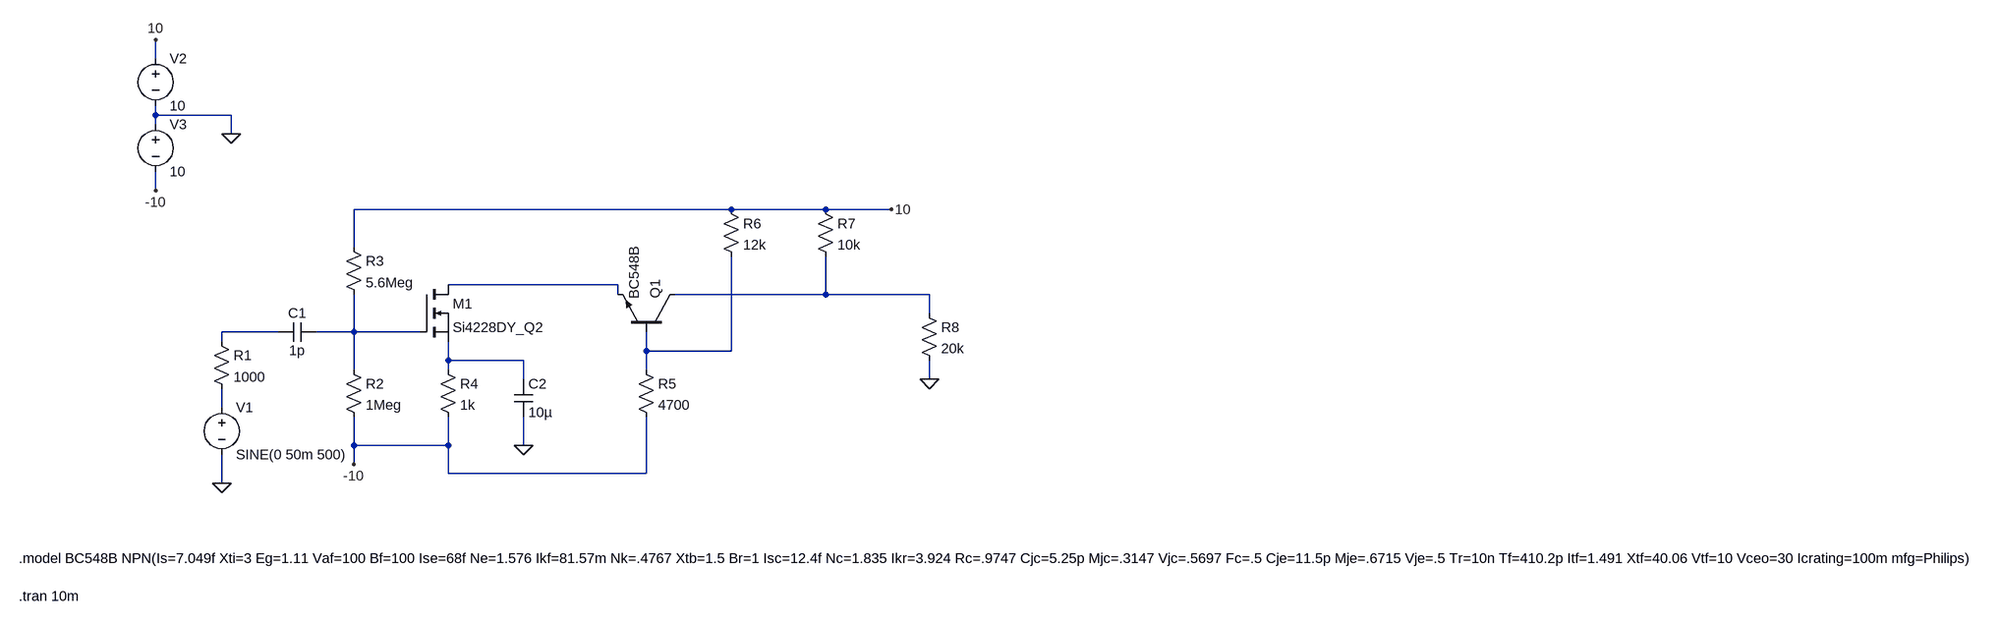
[diagram p0: schematic parcial1.asc]
parcial1.asc, the LTspice schematic file:
Version 4
SHEET 1 3312 680
WIRE -176 -416 -176 -448
WIRE -176 -320 -176 -336
WIRE -48 -320 -176 -320
WIRE -176 -304 -176 -320
WIRE -48 -288 -48 -320
WIRE -176 -192 -176 -224
WIRE 800 -160 160 -160
WIRE 960 -160 800 -160
WIRE 1072 -160 960 -160
WIRE 160 -96 160 -160
WIRE 608 -32 320 -32
WIRE 608 -16 608 -32
WIRE 960 -16 960 -80
WIRE 960 -16 704 -16
WIRE 1136 -16 960 -16
WIRE 1136 16 1136 -16
WIRE 32 48 -64 48
WIRE 160 48 160 -16
WIRE 160 48 96 48
WIRE 272 48 160 48
WIRE -64 64 -64 48
WIRE 656 80 656 48
WIRE 800 80 800 -80
WIRE 800 80 656 80
WIRE 320 96 320 64
WIRE 448 96 320 96
WIRE 160 112 160 48
WIRE 320 112 320 96
WIRE 656 112 656 80
WIRE 448 128 448 96
WIRE 1136 128 1136 96
WIRE -64 176 -64 144
WIRE 160 240 160 192
WIRE 320 240 320 192
WIRE 320 240 160 240
WIRE 448 240 448 192
WIRE 160 272 160 240
WIRE 320 288 320 240
WIRE 656 288 656 192
WIRE 656 288 320 288
WIRE -64 304 -64 256
FLAG -48 -288 0
FLAG -176 -192 -10
FLAG -176 -448 10
FLAG -64 304 0
FLAG 448 240 0
FLAG 1136 128 0
FLAG 1072 -160 10
FLAG 160 272 -10
SYMBOL voltage -64 160 R0
WINDOW 123 0 0 Left 0
WINDOW 39 0 0 Left 0
SYMATTR InstName V1
SYMATTR Value SINE(0 50m 500)
SYMBOL res -80 48 R0
SYMATTR InstName R1
SYMATTR Value 1000
SYMBOL cap 96 32 R90
WINDOW 0 0 32 VBottom 2
WINDOW 3 32 32 VTop 2
SYMATTR InstName C1
SYMATTR Value 1p
SYMBOL res 144 96 R0
SYMATTR InstName R2
SYMATTR Value 1Meg
SYMBOL res 144 -112 R0
SYMATTR InstName R3
SYMATTR Value 5.6Meg
SYMBOL nmos 272 -32 R0
SYMATTR InstName M1
SYMATTR Value Si4228DY_Q2
SYMBOL res 304 96 R0
SYMATTR InstName R4
SYMATTR Value 1k
SYMBOL cap 432 128 R0
SYMATTR InstName C2
SYMATTR Value 10µ
SYMBOL npn 704 48 M270
SYMATTR InstName Q1
SYMATTR Value BC548B
SYMBOL res 640 96 R0
SYMATTR InstName R5
SYMATTR Value 4700
SYMBOL res 784 -176 R0
SYMATTR InstName R6
SYMATTR Value 12k
SYMBOL res 944 -176 R0
SYMATTR InstName R7
SYMATTR Value 10k
SYMBOL res 1120 0 R0
SYMATTR InstName R8
SYMATTR Value 20k
SYMBOL voltage -176 -432 R0
WINDOW 123 0 0 Left 0
WINDOW 39 0 0 Left 0
SYMATTR InstName V2
SYMATTR Value 10
SYMBOL voltage -176 -320 R0
SYMATTR InstName V3
SYMATTR Value 10
TEXT -408 432 Left 2 !.model BC548B NPN(Is=7.049f Xti=3 Eg=1.11 Vaf=100 Bf=100 Ise=68f Ne=1.576 Ikf=81.57m Nk=.4767 Xtb=1.5 Br=1 Isc=12.4f Nc=1.835 Ikr=3.924 Rc=.9747 Cjc=5.25p Mjc=.3147 Vjc=.5697 Fc=.5 Cje=11.5p Mje=.6715 Vje=.5 Tr=10n Tf=410.2p Itf=1.491 Xtf=40.06 Vtf=10 Vceo=30 Icrating=100m mfg=Philips)
TEXT -408 496 Left 2 !.tran 10m

The netlist it stands for:
* parcial1.asc
V1 N007 0 SINE(0 50m 500)
R1 N003 N007 1000
C1 N004 N003 1p
R2 N004 -10 1Meg
R3 10 N004 5.6Meg
M1 N001 N004 N006 N006 Si4228DY_Q2
R4 N006 -10 1k
C2 N006 0 10µ
Q1 N002 N005 N001 0 BC548B
R5 N005 -10 4700
R6 10 N005 12k
R7 10 N002 10k
R8 N002 0 20k
V2 10 0 10
V3 0 -10 10
.model NPN NPN
.model PNP PNP
.lib standard.bjt
.model NMOS NMOS
.model PMOS PMOS
.lib standard.mos
.model BC548B NPN(Is=7.049f Xti=3 Eg=1.11 Vaf=100 Bf=100 Ise=68f Ne=1.576 Ikf=81.57m Nk=.4767 Xtb=1.5 Br=1 Isc=12.4f Nc=1.835 Ikr=3.924 Rc=.9747 Cjc=5.25p Mjc=.3147 Vjc=.5697 Fc=.5 Cje=11.5p Mje=.6715 Vje=.5 Tr=10n Tf=410.2p Itf=1.491 Xtf=40.06 Vtf=10 Vceo=30 Icrating=100m mfg=Philips)
.tran 10m
.backanno
.end